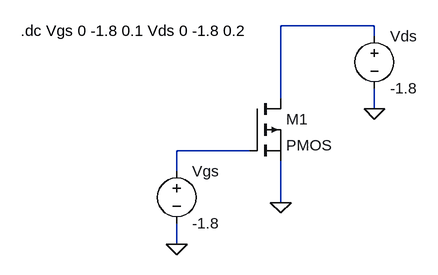
[diagram p0: schematic VI characteristics of discrete PMOS.asc]
VI characteristics of discrete PMOS.asc, the LTspice schematic file:
Version 4
SHEET 1 880 680
WIRE 368 0 224 0
WIRE 368 16 368 0
WIRE 224 112 224 0
WIRE 368 128 368 96
WIRE 176 192 64 192
WIRE 64 224 64 192
WIRE 224 272 224 208
WIRE 64 336 64 304
FLAG 224 272 0
FLAG 64 336 0
FLAG 368 128 0
SYMBOL pmos 176 112 R0
SYMATTR InstName M1
SYMBOL voltage 368 0 R0
WINDOW 123 0 0 Left 0
WINDOW 39 0 0 Left 0
SYMATTR InstName Vds
SYMATTR Value -1.8
SYMBOL voltage 64 208 R0
SYMATTR InstName Vgs
SYMATTR Value -1.8
TEXT -176 8 Left 2 !.dc Vgs 0 -1.8 0.1 Vds 0 -1.8 0.2

The netlist it stands for:
* VI characteristics of discrete PMOS.asc
M1 N001 N002 0 0 PMOS
Vds N001 0 -1.8
Vgs N002 0 -1.8
.model NMOS NMOS
.model PMOS PMOS
.lib standard.mos
.dc Vgs 0 -1.8 0.1 Vds 0 -1.8 0.2
.backanno
.end